# Altium project PCB_Project_2.PrjPcb
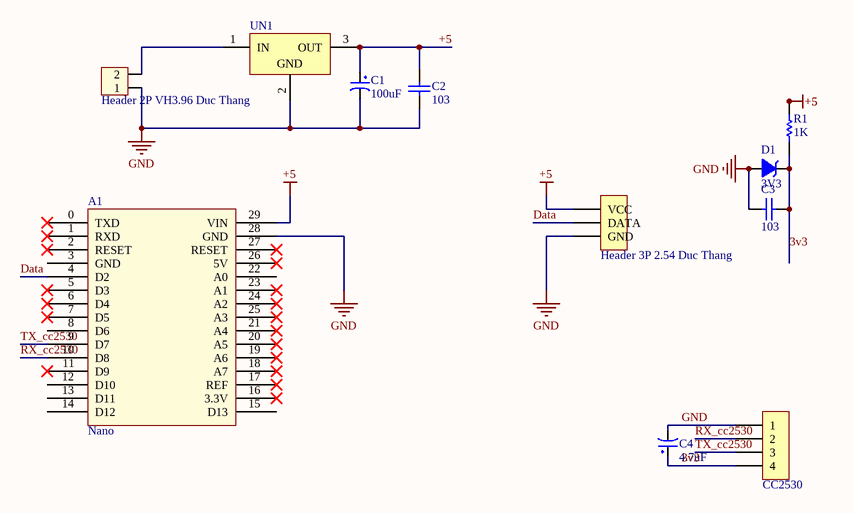
[diagram p0: Sheet1.SchDoc]
1 sheet, 11 parts. Net scope: global (net labels, ports and power ports of the same name join across sheets).
Board file: PCB1.PcbDoc

## Sheet Sheet1.SchDoc
size A

### Parts
A1  Nano  [Arduino nano]
C1  100uF  [tu hoa 5mm]
C2  103  [tu gom]
C3  103  [tu gom]
C4  4.7uF  [tu hoa 8mm]
D1  3V3  [DZ2A]
H1  Header 2P VH3.96 Duc Thang  [VH3.96M-2]
H2  Header 3P 2.54 Duc Thang  [XH2.54M-3]
H3  CC2530  [XH2.54M-4]
R1  value 1K  [R1/4W]  (hidden comment: Res1)
UN1  L78M05CP  [QTO-220H2]  (value not drawn)

### Nets
+5: A1.29(VIN) C1.1 C2.1 H2.1(VCC) R1.2 UN1.3(OUT)
GND: A1.28(GND) C1.2 C2.2 C3.2 C4.2 D1.1(A) H1.1 H2.3(GND) H3.1 UN1.2(GND)
3v3: C3.1 C4.1 D1.2(K) H3.4 R1.1
Data: A1.4(D2) H2.2(DATA)
RX_cc2530: A1.10(D8) H3.2
TX_cc2530: A1.9(D7) H3.3
NetH1_2: H1.2 UN1.1(IN)

Not connected (* = marked no-connect by the designer): A1 0(TXD)* 1(RXD)* 2(RESET)* 3(GND) 5(D3)* 6(D4)* 7(D5)* 8(D6) 11(D9)* 12(D10) 13(D11) 14(D12) 15(D13) 16(3.3V)* 17(REF)* 18(A7)* 19(A6)* 20(A5)* 21(A4)* 22(A0) 23(A1)* 24(A2)* 25(A3)* 26(5V)* 27(RESET)*

### Library data of the parts
A1 = Arduino Nano
C1 = Tu Hoa 100uF 16V 5x7: Cắm; Don_Vi: Con; So_Chan: 2; Ten_Linh_Kien: Tụ Hóa 100uF 16V 5x7MM; Ma_Hang: MH001347; Chung_Loai: Cắm; Kieu_Chan: *
C2 C3 = Tu gom 103 50V: Cắm; So_Chan: 2; Ten_Linh_Kien: Tụ gốm 103 10nF 50V; Don_Vi: Con; Ma_Hang: MH000936; Chung_Loai: Cắm; Kieu_Chan: *
C4 = Tu Hoa 4.7uF 400V 8x12: Cắm; Don_Vi: Con; So_Chan: 2; Ten_Linh_Kien: Tụ Hóa 4.7uF 400V 8x12MM; Ma_Hang: MH003744; Chung_Loai: Cắm; Kieu_Chan: *
D1 = DZ: Diode Zenner; Value: 3v3
H1 = Header 2P VH3.96 Duc Thang: Cắm; Ten_Linh_Kien: Header 2P XH2.54-2P Đực Thẳng; Don_Vi: Con; Ma_Hang: MH001283; Chung_Loai: Cắm
H2 = Header 3P 2.54 Duc Thang: Cắm; Ten_Linh_Kien: Header 3P XH2.54-3P Đực Thẳng; Don_Vi: Con; Ma_Hang: MH001292; Chung_Loai: Cắm
H3 = Header 4P 2.54 Duc Thang: Cắm; Ten_Linh_Kien: Header 4P XH2.54-4P Đực Thẳng; Don_Vi: Con; Ma_Hang: MH001285; Chung_Loai: Cắm
R1 = Res1_4: Resistor; Manufacturer: Generic Components; Class: Passive; Published: 08/06/2000; Publisher: Altium Hobart Technology Centre; SubClass: Resistor
UN1 = L78M05CP: Positive Voltage Regulator; Note: Tab is connected to pin 3 (GND).; Published: 24-Aug-2001; LatestRevisionDate: 17-Jul-2002; LatestRevisionNote: Re-released for DXP Platform.; DatasheetVersion: Apr-1994; PackageVersion: Jul-1998; PackageReference: ISOWATT220AB; Publisher: Altium Limited; PackageDescription: TO, Thru-Hole, Vertical, Heatsink Mounted; 3 In-Line Leads; Pitch 2.54 mm; Pin sequence 1, 3, 2; ComponentLink1Description: Manufacturer Link; ComponentLink1URL: http://www.st.com/; ComponentLink2Description: Datasheet; ComponentLink2URL: http://www.st.com/stonline/products/literature/ds/2146/l78m05c.pdf